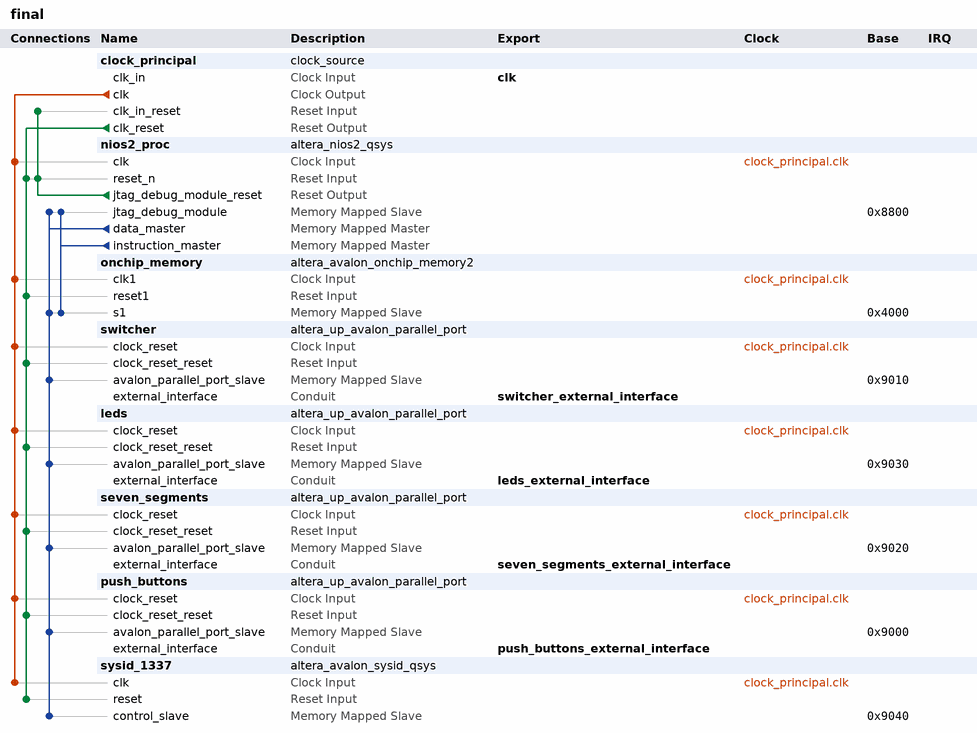
[diagram p0: system contents]
# Platform Designer (Qsys) system final, Cyclone II EP2C35F672C6
# Parameters at their usual value, and those the tool derives, are not listed.
package require -exact qsys 13.0
create_system final
set_project_property DEVICE_FAMILY {Cyclone II}
set_project_property DEVICE EP2C35F672C6

add_instance clock_principal clock_source 13.0
set_instance_parameter_value clock_principal clockFrequency 50000000

add_instance nios2_proc altera_nios2_qsys 13.0
set_instance_parameter_value nios2_proc resetSlave onchip_memory.s1
set_instance_parameter_value nios2_proc mmu_TLBMissExcSlave None
set_instance_parameter_value nios2_proc exceptionSlave onchip_memory.s1
set_instance_parameter_value nios2_proc breakSlave nios2_proc.jtag_debug_module
set_instance_parameter_value nios2_proc impl Tiny
set_instance_parameter_value nios2_proc icache_size 4096

add_instance onchip_memory altera_avalon_onchip_memory2 13.0.1
set_instance_parameter_value onchip_memory dataWidth 32
set_instance_parameter_value onchip_memory dualPort false
set_instance_parameter_value onchip_memory initMemContent true
set_instance_parameter_value onchip_memory initializationFileName onchip_mem.hex
set_instance_parameter_value onchip_memory memorySize 16384

add_instance switcher altera_up_avalon_parallel_port 13.0
set_instance_parameter_value switcher board DE2
set_instance_parameter_value switcher custom_port true
set_instance_parameter_value switcher preset Pushbuttons
set_instance_parameter_value switcher capture false
set_instance_parameter_value switcher edge Rising
set_instance_parameter_value switcher irq false

add_instance leds altera_up_avalon_parallel_port 13.0
set_instance_parameter_value leds board DE2
set_instance_parameter_value leds custom_port true
set_instance_parameter_value leds preset Pushbuttons
set_instance_parameter_value leds capture false
set_instance_parameter_value leds edge Rising
set_instance_parameter_value leds irq false

add_instance seven_segments altera_up_avalon_parallel_port 13.0
set_instance_parameter_value seven_segments board DE2
set_instance_parameter_value seven_segments custom_port true
set_instance_parameter_value seven_segments preset Pushbuttons
set_instance_parameter_value seven_segments capture false
set_instance_parameter_value seven_segments edge Rising
set_instance_parameter_value seven_segments irq false

add_instance push_buttons altera_up_avalon_parallel_port 13.0
set_instance_parameter_value push_buttons board DE2
set_instance_parameter_value push_buttons custom_port true
set_instance_parameter_value push_buttons preset Pushbuttons
set_instance_parameter_value push_buttons capture false
set_instance_parameter_value push_buttons edge Rising
set_instance_parameter_value push_buttons irq false

add_instance sysid_1337 altera_avalon_sysid_qsys 13.0
set_instance_parameter_value sysid_1337 id 4919

# connections
add_connection clock_principal.clk leds.clock_reset clock
add_connection clock_principal.clk nios2_proc.clk clock
add_connection clock_principal.clk onchip_memory.clk1 clock
add_connection clock_principal.clk push_buttons.clock_reset clock
add_connection clock_principal.clk seven_segments.clock_reset clock
add_connection clock_principal.clk switcher.clock_reset clock
add_connection clock_principal.clk sysid_1337.clk clock
add_connection clock_principal.clk_reset leds.clock_reset_reset reset
add_connection clock_principal.clk_reset nios2_proc.reset_n reset
add_connection clock_principal.clk_reset onchip_memory.reset1 reset
add_connection clock_principal.clk_reset push_buttons.clock_reset_reset reset
add_connection clock_principal.clk_reset seven_segments.clock_reset_reset reset
add_connection clock_principal.clk_reset switcher.clock_reset_reset reset
add_connection clock_principal.clk_reset sysid_1337.reset reset
add_connection nios2_proc.jtag_debug_module_reset clock_principal.clk_in_reset reset
add_connection nios2_proc.jtag_debug_module_reset nios2_proc.reset_n reset
add_connection nios2_proc.data_master leds.avalon_parallel_port_slave avalon
set_connection_parameter_value nios2_proc.data_master/leds.avalon_parallel_port_slave baseAddress 0x9030
add_connection nios2_proc.data_master nios2_proc.jtag_debug_module avalon
set_connection_parameter_value nios2_proc.data_master/nios2_proc.jtag_debug_module baseAddress 0x8800
add_connection nios2_proc.data_master onchip_memory.s1 avalon
set_connection_parameter_value nios2_proc.data_master/onchip_memory.s1 baseAddress 0x4000
add_connection nios2_proc.data_master push_buttons.avalon_parallel_port_slave avalon
set_connection_parameter_value nios2_proc.data_master/push_buttons.avalon_parallel_port_slave baseAddress 0x9000
add_connection nios2_proc.data_master seven_segments.avalon_parallel_port_slave avalon
set_connection_parameter_value nios2_proc.data_master/seven_segments.avalon_parallel_port_slave baseAddress 0x9020
add_connection nios2_proc.data_master switcher.avalon_parallel_port_slave avalon
set_connection_parameter_value nios2_proc.data_master/switcher.avalon_parallel_port_slave baseAddress 0x9010
add_connection nios2_proc.data_master sysid_1337.control_slave avalon
set_connection_parameter_value nios2_proc.data_master/sysid_1337.control_slave baseAddress 0x9040
add_connection nios2_proc.instruction_master nios2_proc.jtag_debug_module avalon
set_connection_parameter_value nios2_proc.instruction_master/nios2_proc.jtag_debug_module baseAddress 0x8800
add_connection nios2_proc.instruction_master onchip_memory.s1 avalon
set_connection_parameter_value nios2_proc.instruction_master/onchip_memory.s1 baseAddress 0x4000

# exported interfaces
add_interface clk clock sink
set_interface_property clk EXPORT_OF clock_principal.clk_in
add_interface switcher_external_interface conduit end
set_interface_property switcher_external_interface EXPORT_OF switcher.external_interface
add_interface leds_external_interface conduit end
set_interface_property leds_external_interface EXPORT_OF leds.external_interface
add_interface seven_segments_external_interface conduit end
set_interface_property seven_segments_external_interface EXPORT_OF seven_segments.external_interface
add_interface push_buttons_external_interface conduit end
set_interface_property push_buttons_external_interface EXPORT_OF push_buttons.external_interface

set_interconnect_requirement {$system} qsys_mm.clockCrossingAdapter HANDSHAKE
set_interconnect_requirement {$system} qsys_mm.maxAdditionalLatency 1

save_system final.qsys
